# Altium schematic sheet [01]-COVERPAGE.SchDoc: L_Projekt-Name
size A3; Ingenieur: Stephan Diel; Organization: Sykam GmbH; Address1: Gewerbering 15; Address2: 86922 Eresing; Address3: Germany; Address4: https://sykam.com; DocumentNumber: 1; SheetNumber: 1; SheetTotal: 13; Status: Release
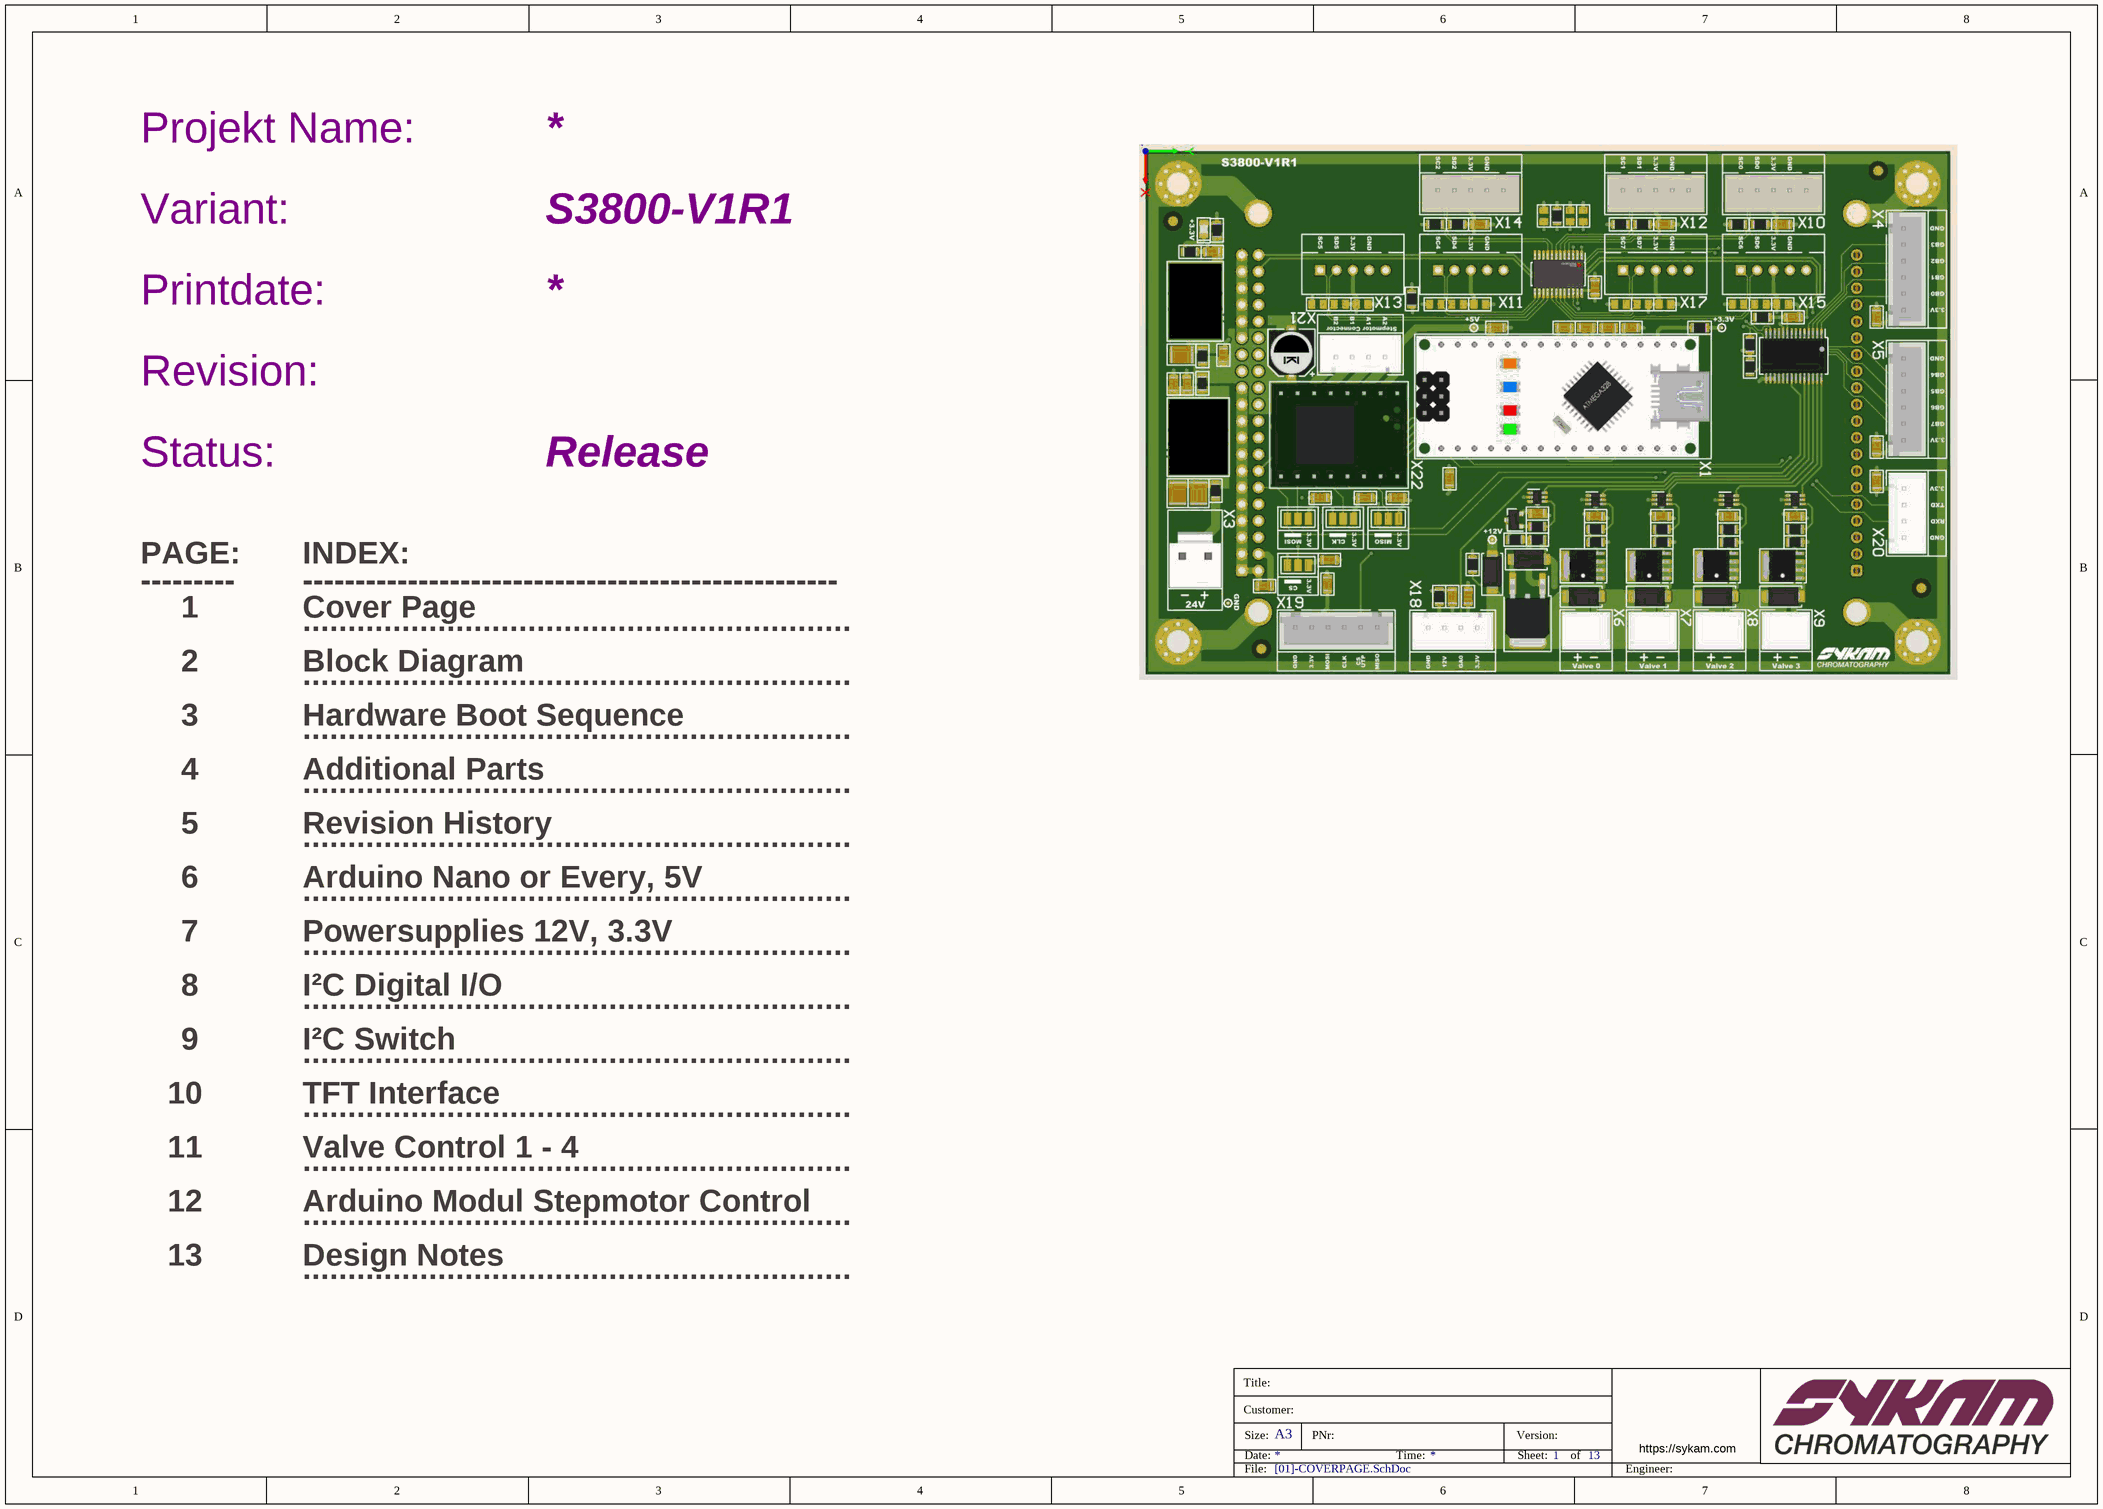
[diagram p0: [01]-COVERPAGE.SchDoc]

## Notes on the sheet
- Projekt Name:
- Variant:
- S3800-V1R1
- Printdate:
- Revision:
- Status:
- PAGE:
- INDEX:
- ---------
- 1
- ---------------------------------------------------
- .............................................................
- Cover Page
- 2
- Block Diagram
- 3
- 4
- Hardware Boot Sequence
- Additional Parts
- 5
- Revision History
- 6
- Arduino Nano or Every, 5V
- 7
- Powersupplies 12V, 3.3V
- 8
- 9
- I²C Digital I/O
- I²C Switch
- 10
- TFT Interface
- 11
- Valve Control 1 - 4
- 12
- Arduino Modul Stepmotor Control
- 13
- Design Notes
- Title:
- Customer:
- Size:
- Date:
- A3
- PNr:
- Time:
- Version:
- Sheet:
- of
- File:
- Engineer: